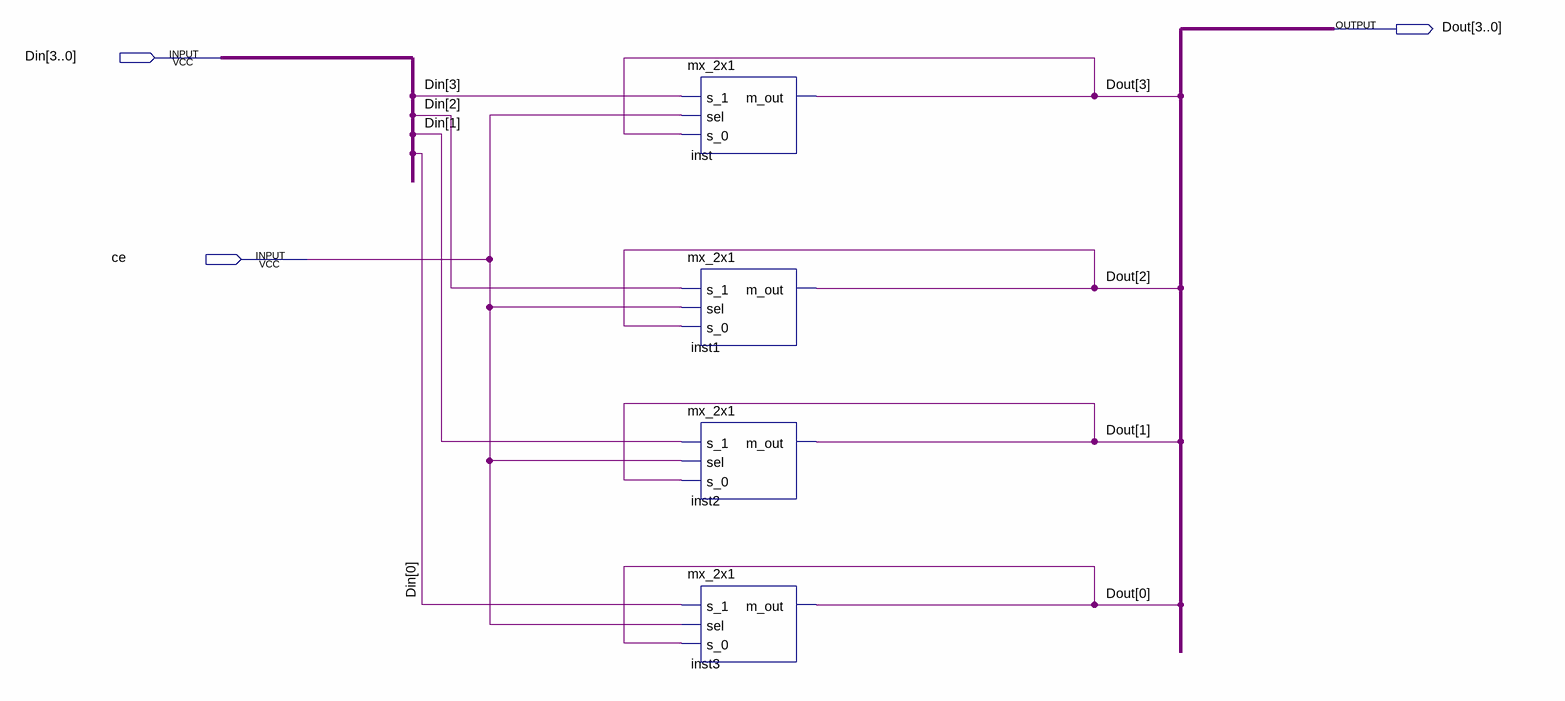
[diagram p0: schematic sheet]
// Quartus schematic new_fourbit_re_ce.bdf as structural Verilog: 4 symbols, 3 pins
module new_fourbit_re_ce (
  input  [3:0] Din,
  input  ce,
  output [3:0] Dout
);

  mx_2x1 inst (.s_1(Din[3]), .sel(ce), .s_0(Dout[3]), .m_out(Dout[3]));
  mx_2x1 inst1 (.s_1(Din[2]), .sel(ce), .s_0(Dout[2]), .m_out(Dout[2]));
  mx_2x1 inst2 (.s_1(Din[1]), .sel(ce), .s_0(Dout[1]), .m_out(Dout[1]));
  mx_2x1 inst3 (.s_1(Din[0]), .sel(ce), .s_0(Dout[0]), .m_out(Dout[0]));
endmodule
